# EAGLE design XE167FM (EAGLE 6.4)
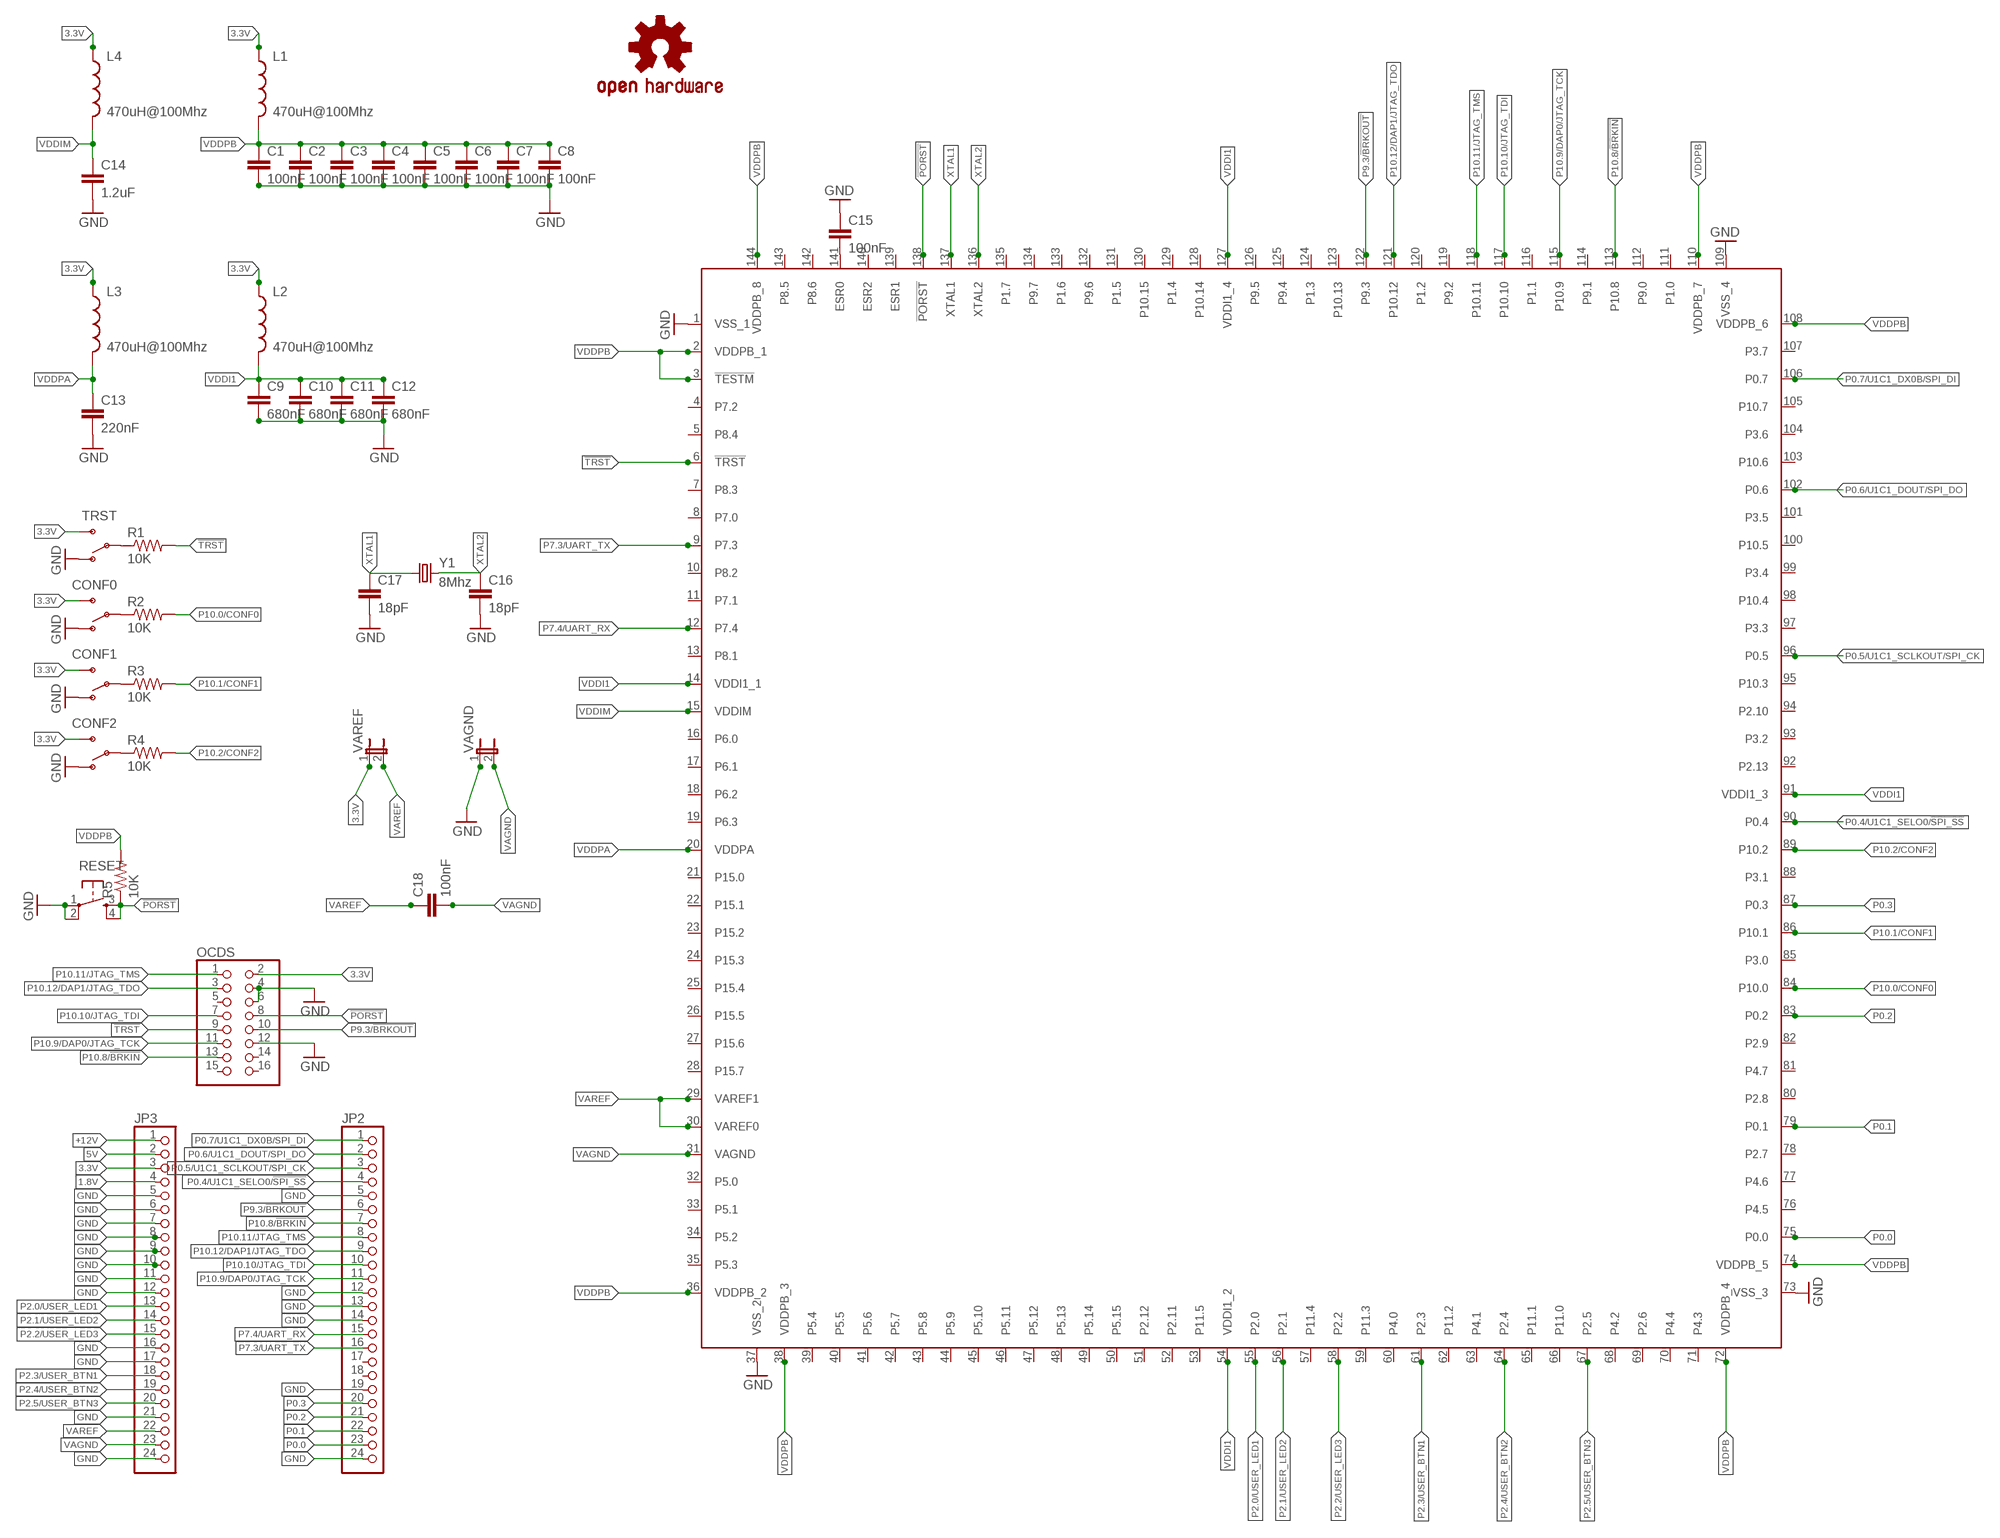
[diagram p0: schematic, sheet 1]

## Parts
C1  100nF  CAP0603-CAP  [0603-CAP]
C2  100nF  CAP0603-CAP  [0603-CAP]
C3  100nF  CAP0603-CAP  [0603-CAP]
C4  100nF  CAP0603-CAP  [0603-CAP]
C5  100nF  CAP0603-CAP  [0603-CAP]
C6  100nF  CAP0603-CAP  [0603-CAP]
C7  100nF  CAP0603-CAP  [0603-CAP]
C8  100nF  CAP0603-CAP  [0603-CAP]
C9  680nF  CAP0603-CAP  [0603-CAP]
C10  680nF  CAP0603-CAP  [0603-CAP]
C11  680nF  CAP0603-CAP  [0603-CAP]
C12  680nF  CAP0603-CAP  [0603-CAP]
C13  220nF  CAP0603-CAP  [0603-CAP]
C14  1.2uF  CAP0603-CAP  [0603-CAP]
C15  100nF  CAP0603-CAP  [0603-CAP]
C16  18pF  CAP0603-CAP  [0603-CAP]
C17  18pF  CAP0603-CAP  [0603-CAP]
C18  100nF  CAP0603-CAP  [0603-CAP]
CONF0  SWITCH-SPDTPTH  [SWITCH-SPDT]
CONF1  SWITCH-SPDTPTH  [SWITCH-SPDT]
CONF2  SWITCH-SPDTPTH  [SWITCH-SPDT]
IC1  XE167FM  [LQFP144]
JP2  PINHD-1X24  [1X24]
JP3  PINHD-1X24  [1X24]
L1  470uH@100Mhz  INDUCTOR0603  [0603]
L2  470uH@100Mhz  INDUCTOR0603  [0603]
L3  470uH@100Mhz  INDUCTOR0603  [0603]
L4  470uH@100Mhz  INDUCTOR0603  [0603]
LOGO1  OSHW-LOGOS  [OSHW-LOGO-S]
OCDS  PINHD-2X8_2.54  [2X08]
R1  10K  RESISTOR0603-RES  [0603-RES]
R2  10K  RESISTOR0603-RES  [0603-RES]
R3  10K  RESISTOR0603-RES  [0603-RES]
R4  10K  RESISTOR0603-RES  [0603-RES]
R5  10K  RESISTOR0603-RES  [0603-RES]
RESET  TAC_SWITCHPTH  [TACTILE-PTH]
TRST  SWITCH-SPDTPTH  [SWITCH-SPDT]
VAGND  JP1E  [JP1]
VAREF  JP1E  [JP1]
Y1  8Mhz  CRYSTALSMD  [HC49UP]

## Nets
1.8V: JP3.4
3.3V: CONF0.3(S) CONF1.3(S) CONF2.3(S) JP3.3 L1.1 L2.1 L3.1 L4.1 OCDS.2 TRST.3(S) VAREF.1
5V: JP3.2
!PORST: IC1.138(!PORST) OCDS.8 R5.1 RESET.3 RESET.4
!TRST: IC1.6(!TRST) OCDS.9 R1.2
+12V: JP3.1
GND: C1.2 C2.2 C3.2 C4.2 C5.2 C6.2 C7.2 C8.2 C9.2 C10.2 C11.2 C12.2 C13.2 C14.2 C15.1 C16.2 C17.2 CONF0.1(O) CONF1.1(O) CONF2.1(O) IC1.1(VSS_1) IC1.37(VSS_2) IC1.73(VSS_3) IC1.109(VSS_4) JP2.5 JP2.12 JP2.13 JP2.14 JP2.19 JP2.24 JP3.5 JP3.6 JP3.7 JP3.8 JP3.9 JP3.10 JP3.11 JP3.12 JP3.16 JP3.17 JP3.21 JP3.24 OCDS.4 OCDS.6 OCDS.12 RESET.1 RESET.2 TRST.1(O) VAGND.1
N$1: R1.1 TRST.2(P)
N$2: CONF0.2(P) R2.1
N$3: CONF1.2(P) R3.1
N$4: CONF2.2(P) R4.1
N$5: C15.2 IC1.141(ESR0)
P0.0: IC1.75(P0.0) JP2.23
P0.1: IC1.79(P0.1) JP2.22
P0.2: IC1.83(P0.2) JP2.21
P0.3: IC1.87(P0.3) JP2.20
P0.4/U1C1_SELO0/!SPI_SS: IC1.90(P0.4) JP2.4
P0.5/U1C1_SCLKOUT/SPI_CK: IC1.96(P0.5) JP2.3
P0.6/U1C1_DOUT/SPI_DO: IC1.102(P0.6) JP2.2
P0.7/U1C1_DX0B/SPI_DI: IC1.106(P0.7) JP2.1
P2.0/USER_LED1: IC1.55(P2.0) JP3.13
P2.1/USER_LED2: IC1.56(P2.1) JP3.14
P2.2/USER_LED3: IC1.58(P2.2) JP3.15
P2.3/USER_BTN1: IC1.61(P2.3) JP3.18
P2.4/USER_BTN2: IC1.64(P2.4) JP3.19
P2.5/USER_BTN3: IC1.67(P2.5) JP3.20
P7.3/UART_TX: IC1.9(P7.3) JP2.16
P7.4/UART_RX: IC1.12(P7.4) JP2.15
P9.3/!BRKOUT: IC1.122(P9.3) JP2.6 OCDS.10
P10.0/CONF0: IC1.84(P10.0) R2.2
P10.1/CONF1: IC1.86(P10.1) R3.2
P10.2/CONF2: IC1.89(P10.2) R4.2
P10.8/!BRKIN: IC1.113(P10.8) JP2.7 OCDS.13
P10.9/DAP0/JTAG_TCK: IC1.115(P10.9) JP2.11 OCDS.11
P10.10/JTAG_TDI: IC1.117(P10.10) JP2.10 OCDS.7
P10.11/JTAG_TMS: IC1.118(P10.11) JP2.8 OCDS.1
P10.12/DAP1/JTAG_TDO: IC1.121(P10.12) JP2.9 OCDS.3
VAGND: C18.2 IC1.31(VAGND) JP3.23 VAGND.2
VAREF: C18.1 IC1.29(VAREF1) IC1.30(VAREF0) JP3.22 VAREF.2
VDDI1: C9.1 C10.1 C11.1 C12.1 IC1.14(VDDI1_1) IC1.54(VDDI1_2) IC1.91(VDDI1_3) IC1.127(VDDI1_4) L2.2
VDDIM: C14.1 IC1.15(VDDIM) L4.2
VDDPA: C13.1 IC1.20(VDDPA) L3.2
VDDPB: C1.1 C2.1 C3.1 C4.1 C5.1 C6.1 C7.1 C8.1 IC1.2(VDDPB_1) IC1.3(!TESTM) IC1.36(VDDPB_2) IC1.38(VDDPB_3) IC1.72(VDDPB_4) IC1.74(VDDPB_5) IC1.108(VDDPB_6) IC1.110(VDDPB_7) IC1.144(VDDPB_8) L1.2 R5.2
XTAL1: C17.1 IC1.137(XTAL1) Y1.1
XTAL2: C16.1 IC1.136(XTAL2) Y1.2
Unconnected: IC1.4(P7.2) IC1.5(P8.4) IC1.7(P8.3) IC1.8(P7.0) IC1.10(P8.2) IC1.11(P7.1) IC1.13(P8.1) IC1.16(P6.0) IC1.17(P6.1) IC1.18(P6.2) IC1.19(P6.3) IC1.21(P15.0) IC1.22(P15.1) IC1.23(P15.2) IC1.24(P15.3) IC1.25(P15.4) IC1.26(P15.5) IC1.27(P15.6) IC1.28(P15.7) IC1.32(P5.0) IC1.33(P5.1) IC1.34(P5.2) IC1.35(P5.3) IC1.39(P5.4) IC1.40(P5.5) IC1.41(P5.6) IC1.42(P5.7) IC1.43(P5.8) IC1.44(P5.9) IC1.45(P5.10) IC1.46(P5.11) IC1.47(P5.12) IC1.48(P5.13) IC1.49(P5.14) IC1.50(P5.15) IC1.51(P2.12) IC1.52(P2.11) IC1.53(P11.5) IC1.57(P11.4) IC1.59(P11.3) IC1.60(P4.0) IC1.62(P11.2) IC1.63(P4.1) IC1.65(P11.1) IC1.66(P11.0) IC1.68(P4.2) IC1.69(P2.6) IC1.70(P4.4) IC1.71(P4.3) IC1.76(P4.5) IC1.77(P4.6) IC1.78(P2.7) IC1.80(P2.8) IC1.81(P4.7) IC1.82(P2.9) IC1.85(P3.0) IC1.88(P3.1) IC1.92(P2.13) IC1.93(P3.2) IC1.94(P2.10) IC1.95(P10.3) IC1.97(P3.3) IC1.98(P10.4) IC1.99(P3.4) IC1.100(P10.5) IC1.101(P3.5) IC1.103(P10.6) IC1.104(P3.6) IC1.105(P10.7) IC1.107(P3.7) IC1.111(P1.0) IC1.112(P9.0) IC1.114(P9.1) IC1.116(P1.1) IC1.119(P9.2) IC1.120(P1.2) IC1.123(P10.13) IC1.124(P1.3) IC1.125(P9.4) IC1.126(P9.5) IC1.128(P10.14) IC1.129(P1.4) IC1.130(P10.15) IC1.131(P1.5) IC1.132(P9.6) IC1.133(P1.6) IC1.134(P9.7) IC1.135(P1.7) IC1.139(ESR1) IC1.140(ESR2) IC1.142(P8.6) IC1.143(P8.5) JP2.17 JP2.18 OCDS.5 OCDS.14 OCDS.15 OCDS.16

## Library data of the parts
C1-C18 = SparkFun-Capacitors:CAP: Capacitor Standard 0603 ceramic capacitor, and 0.1" leaded capacitor.
CONF0 CONF1 CONF2 TRST = SparkFun-Electromechanical:SWITCH-SPDT: SPDT Switch Simple slide switch, Spark Fun Electronics SKU : COM-00102 DPDT SMT slide switch, AYZ0202, SWCH-08179
IC1 = xe167_lqfp144:XE167FM: Infineon XE167FM
JP2 JP3 = pinhead:PINHD-1X24: PIN HEADER
L1-L4 = SparkFun-Passives:INDUCTOR: Inductors Basic Inductor/Choke - 0603 and 1206. Footprints are not proven and vary greatly between part numbers.
LOGO1 = SparkFun-Aesthetics:OSHW-LOGO: Open Source Hardware Logo This logo indicates the piece of hardware it is found on incorporates a OSHW license and/or adheres to the definition of open source hardware found here: http://freedomdefined.org/OSHW
OCDS = pinhead:PINHD-2X8: PIN HEADER
R1-R5 = SparkFun-Resistors:RESISTOR: Resistor Basic schematic elements and footprints for 0603, 1206, and PTH resistors.
RESET = SparkFun-Electromechanical:TAC_SWITCH: Momentary Switch Button commonly used for reset or general input. Spark Fun Electronics SKU : COM-00097 SMT- SWCH-08247
VAGND VAREF = jumper:JP1E: JUMPER
Y1 = SparkFun-FreqCtrl:CRYSTAL: Various standard crystals. Proven footprints. Spark Fun Electronics SKU : COM-00534

## Net classes
0 default: clearance 0.355 mm

## Board
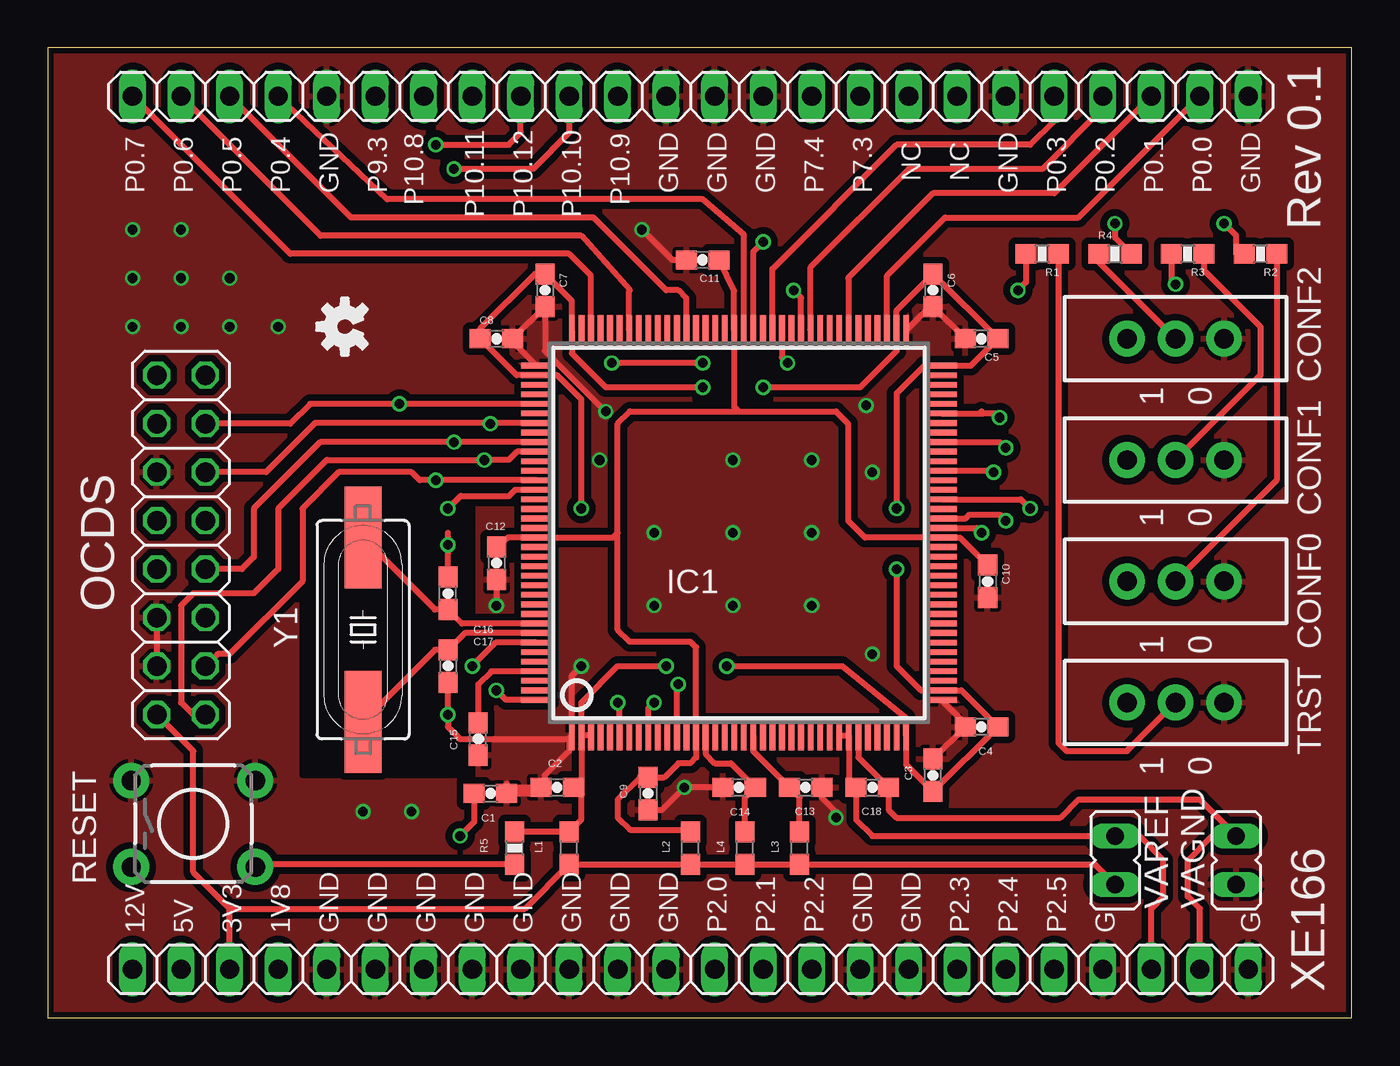
[diagram p1: board, top side]
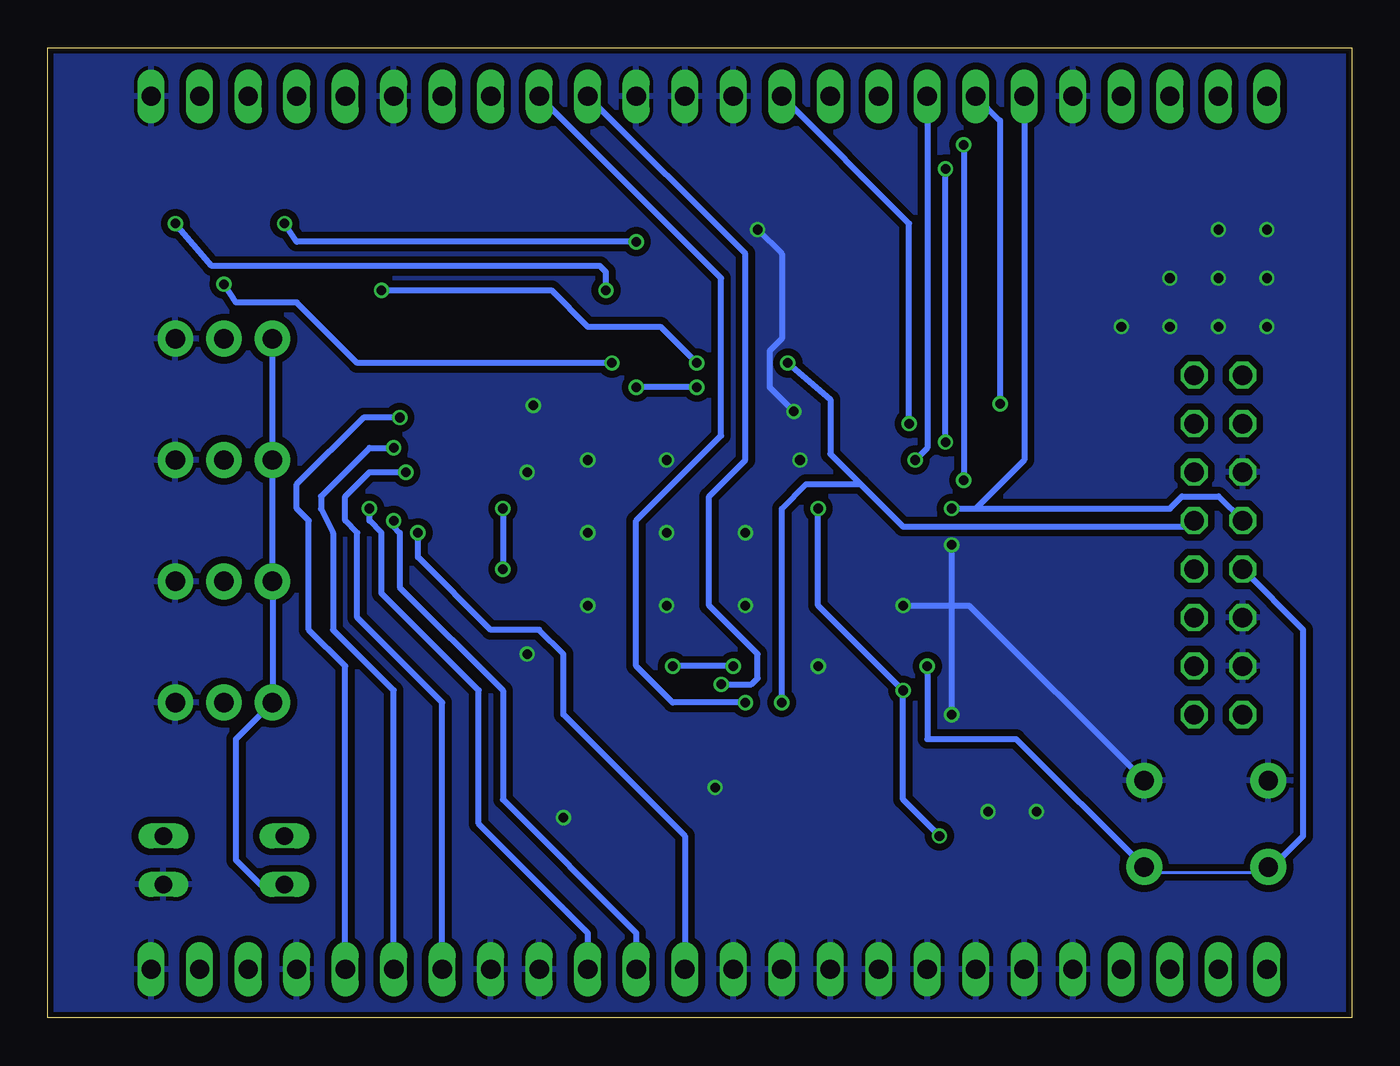
[diagram p2: board, bottom side, seen from below]

Size 68.28 x 50.8 mm. Coordinates in mm from the lower left corner, seen from the top.
Outline: 0,0 68.28,0 68.28,50.8 0,50.8 0,0
Copper layers (1*16): Top 0.035mm / dielectric 1.5mm / Bottom 0.035mm
Design rules "PCB-POOL Standard": minimum track width 0.15mm, minimum drill 0.3mm, track to track 0.15mm, track to pad 0.15mm, pad to pad 0.15mm, via to via 0.15mm, smd to smd 0.15mm, copper to edge 0.3mm, drill to drill 0.2mm, minimum pad ring 0.2mm, minimum via ring 0.15mm, stop-mask expansion 0.075mm, vias tented up to drill 0mil, thermal gap 0.2mm

### Footprints (pad centres in the part's own frame; a part is rotated, then mirrored left to right if it is on the bottom)
0603-CAP = smd 1.1 x 1: 1 -0.85,0; 2 0.85,0
SWITCH-SPDT = drill 1.016 pad 1.88: 1 0,2.54; 2 0,0; 3 0,-2.54
LQFP144 = smd 0.3 x 1.6: 1 -17.64,-13.14; 2 -17.14,-13.14; 3 -16.64,-13.14; 4 -16.14,-13.14; 5 -15.64,-13.14; 6 -15.14,-13.14; 7 -14.64,-13.14; 8 -14.14,-13.14; 9 -13.64,-13.14; 10 -13.14,-13.14; 11 -12.64,-13.14; 12 -12.14,-13.14; 13 -11.64,-13.14; 14 -11.14,-13.14; 15 -10.64,-13.14; 16 -10.14,-13.14; 17 -9.64,-13.14; 18 -9.14,-13.14; 19 -8.64,-13.14; 20 -8.14,-13.14; 21 -7.64,-13.14; 22 -7.14,-13.14; 23 -6.64,-13.14; 24 -6.14,-13.14; 25 -5.64,-13.14; 26 -5.14,-13.14; 27 -4.64,-13.14; 28 -4.14,-13.14; 29 -3.64,-13.14; 30 -3.14,-13.14; 31 -2.64,-13.14; 32 -2.14,-13.14; 33 -1.64,-13.14; 34 -1.14,-13.14; 35 -0.64,-13.14; 36 -0.14,-13.14; 73 -0.14,8.06; 74 -0.64,8.06; 75 -1.14,8.06; 76 -1.64,8.06; 77 -2.14,8.06; 78 -2.64,8.06; 79 -3.14,8.06; 80 -3.64,8.06; 81 -4.14,8.06; 82 -4.64,8.06; 83 -5.14,8.06; 84 -5.64,8.06; 85 -6.14,8.06; 86 -6.64,8.06; 87 -7.14,8.06; 88 -7.64,8.06; 89 -8.14,8.06; 90 -8.64,8.06; 91 -9.14,8.06; 92 -9.64,8.06; 93 -10.14,8.06; 94 -10.64,8.06; 95 -11.14,8.06; 96 -11.64,8.06; 97 -12.14,8.06; 98 -12.64,8.06; 99 -13.14,8.06; 100 -13.64,8.06; 101 -14.14,8.06; 102 -14.64,8.06; 103 -15.14,8.06; 104 -15.64,8.06; 105 -16.14,8.06; 106 -16.64,8.06; 107 -17.14,8.06; 108 -17.64,8.06 | smd 1.6 x 0.3: 37 1.71,-11.29; 38 1.71,-10.79; 39 1.71,-10.29; 40 1.71,-9.79; 41 1.71,-9.29; 42 1.71,-8.79; 43 1.71,-8.29; 44 1.71,-7.79; 45 1.71,-7.29; 46 1.71,-6.79; 47 1.71,-6.29; 48 1.71,-5.79; 49 1.71,-5.29; 50 1.71,-4.79; 51 1.71,-4.29; 52 1.71,-3.79; 53 1.71,-3.29; 54 1.71,-2.79; 55 1.71,-2.29; 56 1.71,-1.79; 57 1.71,-1.29; 58 1.71,-0.79; 59 1.71,-0.29; 60 1.71,0.21; 61 1.71,0.71; 62 1.71,1.21; 63 1.71,1.71; 64 1.71,2.21; 65 1.71,2.71; 66 1.71,3.21; 67 1.71,3.71; 68 1.71,4.21; 69 1.71,4.71; 70 1.71,5.21; 71 1.71,5.71; 72 1.71,6.21; 109 -19.49,6.21; 110 -19.49,5.71; 111 -19.49,5.21; 112 -19.49,4.71; 113 -19.49,4.21; 114 -19.49,3.71; 115 -19.49,3.21; 116 -19.49,2.71; 117 -19.49,2.21; 118 -19.49,1.71; 119 -19.49,1.21; 120 -19.49,0.71; 121 -19.49,0.21; 122 -19.49,-0.29; 123 -19.49,-0.79; 124 -19.49,-1.29; 125 -19.49,-1.79; 126 -19.49,-2.29; 127 -19.49,-2.79; 128 -19.49,-3.29; 129 -19.49,-3.79; 130 -19.49,-4.29; 131 -19.49,-4.79; 132 -19.49,-5.29; 133 -19.49,-5.79; 134 -19.49,-6.29; 135 -19.49,-6.79; 136 -19.49,-7.29; 137 -19.49,-7.79; 138 -19.49,-8.29; 139 -19.49,-8.79; 140 -19.49,-9.29; 141 -19.49,-9.79; 142 -19.49,-10.29; 143 -19.49,-10.79; 144 -19.49,-11.29
1X24 = drill 1.016 long: 1 -29.21,0; 2 -26.67,0; 3 -24.13,0; 4 -21.59,0; 5 -19.05,0; 6 -16.51,0; 7 -13.97,0; 8 -11.43,0; 9 -8.89,0; 10 -6.35,0; 11 -3.81,0; 12 -1.27,0; 13 1.27,0; 14 3.81,0; 15 6.35,0; 16 8.89,0; 17 11.43,0; 18 13.97,0; 19 16.51,0; 20 19.05,0; 21 21.59,0; 22 24.13,0; 23 26.67,0; 24 29.21,0
0603 = smd 1.1 x 1: 1 -0.85,0; 2 0.85,0
2X08 = drill 1.016 octagon: 1 -8.89,-1.27; 2 -8.89,1.27; 3 -6.35,-1.27; 4 -6.35,1.27; 5 -3.81,-1.27; 6 -3.81,1.27; 7 -1.27,-1.27; 8 -1.27,1.27; 9 1.27,-1.27; 10 1.27,1.27; 11 3.81,-1.27; 12 3.81,1.27; 13 6.35,-1.27; 14 6.35,1.27; 15 8.89,-1.27; 16 8.89,1.27
0603-RES = smd 1.1 x 1: 1 -0.85,0; 2 0.85,0
TACTILE-PTH = drill 1.016 pad 1.88: 1 -3.251,2.261; 2 3.251,2.261; 3 -3.251,-2.261; 4 3.251,-2.261
JP1 = drill 0.914 long: 1 0,-1.27; 2 0,1.27
HC49UP = smd 5.334 x 1.93: 1 -4.826,0; 2 4.826,0

### Placement (x,y rotation side)
C1  23.18,11.75 0 top
C2  26.67,12.06 180 top
C3  46.36,12.7 90 top
C4  48.9,15.24 180 top
C5  48.9,35.56 180 top
C6  46.36,38.1 270 top
C7  26.04,38.1 270 top
C8  23.5,35.56 0 top
C9  31.43,11.75 270 top
C10  49.21,22.86 270 top
C11  34.29,39.69 180 top
C12  23.5,23.81 270 top
C13  39.69,12.06 0 top
C14  36.2,12.06 180 top
C15  22.54,14.61 90 top
C16  20.96,22.23 90 top
C17  20.96,18.41 270 top
C18  43.18,12.06 0 top
CONF0  59.05,22.86 270 top
CONF1  59.05,29.21 270 top
CONF2  59.05,35.56 270 top
IC1  45.09,27.94 0 top
JP2  33.66,48.26 0 top
JP3  33.66,2.54 0 top
L1  27.3,8.89 90 top
L2  33.66,8.89 90 top
L3  39.37,8.89 90 top
L4  36.51,8.89 90 top
LOGO1  15.56,36.2 90 top
OCDS  6.99,24.77 90 top
R1  52.07,40.01 180 top
R2  63.5,40.01 180 top
R3  59.69,40.01 180 top
R4  55.88,40.01 0 top
R5  24.45,8.89 90 top
RESET  7.62,10.16 0 top
TRST  59.05,16.51 270 top
VAGND  62.23,8.26 0 top
VAREF  55.88,8.26 0 top
Y1  16.51,20.32 90 top

### Tracks (layer width: path | path; a pad name or v marks a point on that pad's centre or on a via)
3.3V
  Top 0.305: JP3.3 9.53,5.71 | 9.53,5.71 7.62,7.62 7.62,13.97 OCDS.2 | 9.53,5.71 24.98,5.71 L1.1 L2.1 L4.1 L3.1 54.83,8.04 VAREF.1
  Bottom 0.305: VAREF.1 57.15,6.99 58.42,8.26 58.42,14.61 TRST.3 CONF0.3 CONF1.3 CONF2.3
!PORST  (via drill 0.5)
  Top 0.305: IC1.138 23.46,19.65 v22.23,18.41 | R5.1 11.01,8.04 RESET.4
  Bottom 0.15: RESET.3 4.45,7.62 10.79,7.62 RESET.4
  Bottom 0.305: v22.23,18.41 22.23,14.61 17.58,14.61 RESET.4 | RESET.3 4.17,7.9 2.54,9.53 2.54,20.32 OCDS.8
!TRST  (via drill 0.5)
  Top 0.305: IC1.6 29.95,16.41 v29.85,16.51 | v34.29,34.29 v29.53,34.29 | R1.2 51.22,38.52 v50.8,38.1
  Bottom 0.305: v29.85,16.51 29.85,26.67 28.58,27.94 25.72,27.94 | 25.72,27.94 23.5,25.72 8.57,25.72 OCDS.9 | v50.8,38.1 41.91,38.1 40.01,36.2 36.2,36.2 v34.29,34.29 | v29.53,34.29 27.3,32.38 27.3,29.53 25.72,27.94
GND  (via drill 0.5)
  Top 0.305: OCDS.6 OCDS.4 | 27.25,14.61 21.59,14.61 20.96,15.24 v20.96,15.88 C17.2 | 27.25,14.61 IC1.1 27.45,17.92 v27.94,18.41 | C16.2 v20.96,24.77 20.96,25.4 | C5.2 C6.2 46.2,37.25 IC1.73 | IC1.109 24.35,35.4 C8.2 C7.2 26.04,34.92 v29.21,31.75 | C3.2 C4.2 48.05,15.4 IC1.37 | C9.2 32.17,10.9 v33.34,12.06 C14.2 | C13.2 40.54,11.53 41.27,10.79 v41.27,10.48 | C11.2 32.7,39.69 v31.12,41.27 | C12.2 v23.5,21.59 | 24.03,12.27 C1.2 25.5,11.75 C2.2 | C15.1 22.54,13.65 | 24.13,12.06 26.04,12.06 26.04,12.7 27.3,13.97 27.3,14.61 27.25,14.61
  Bottom 0.305: v20.96,24.77 v20.96,15.88 | v23.5,21.59 20.04,21.59 RESET.2 | v31.12,41.27 29.85,40.01 29.85,35.56 30.48,34.92 30.48,33.02 v29.21,31.75
  other vias: 42.86,32.07 43.18,28.57 35.88,25.4 40.01,25.4 31.75,25.4 31.75,21.59 35.88,29.21 40.01,29.21 40.01,21.59 35.88,21.59 43.18,19.05 28.89,29.21 4.45,41.27 4.45,38.73 4.45,36.2 6.99,38.73 9.53,38.73 6.99,36.2 9.53,36.2 6.99,41.27 12.06,36.2 16.51,10.79 19.05,10.79
  pour Top: 23.5,38.1 48.9,38.1 48.9,12.7 23.5,12.7
  pour Bottom (isolate 0.305): 0,50.8 67.95,50.8 67.95,0 0,0
  pour Top (isolate 0.305): 0,50.8 67.95,50.8 67.95,0 0,0
N$1
  Top 0.305: R1.1 52.92,14.39 53.34,13.97 56.52,13.97 TRST.2
N$2
  Top 0.305: R2.1 64.35,28.16 CONF0.2
N$3
  Top 0.305: R3.1 60.54,39.16 63.5,36.2 63.5,33.66 CONF1.2
N$4
  Top 0.305: R4.1 55.03,39.59 CONF2.2
N$5
  Top 0.305: IC1.141 23.23,18.15 22.54,17.46 C15.2
OSC
  cutout Top: 13.33,27.94 22.23,27.94 22.23,12.7 13.33,12.7
P0.0
  Top 0.305: IC1.75 43.95,38.87 46.99,41.91 53.98,41.91 JP2.23
P0.1
  Top 0.305: JP2.22 52.7,43.18 46.36,43.18 41.91,38.73 41.95,38.7 IC1.79
P0.2
  Top 0.305: JP2.21 55.25,47.62 52.07,44.45 45.09,44.45 39.95,39.31 IC1.83
P0.3
  Top 0.305: JP2.20 52.7,46.99 51.44,45.72 44.45,45.72 37.95,39.22 IC1.87
P0.4/U1C1_SELO0/!SPI_SS
  Top 0.305: IC1.90 36.45,41.02 34.29,42.86 17.78,42.86 JP2.4
P0.5/U1C1_SCLKOUT/SPI_CK
  Top 0.305: IC1.96 33.45,37.67 33.02,38.1 32.38,38.1 28.58,41.91 15.88,41.91 JP2.3
P0.6/U1C1_DOUT/SPI_DO
  Top 0.305: IC1.102 30.45,38.06 30.48,38.1 27.94,40.96 14.29,40.96 JP2.2
P0.7/U1C1_DX0B/SPI_DI
  Top 0.305: IC1.106 28.45,38.87 27.3,40.01 12.7,40.01 JP2.1
P2.0/USER_LED1  (via drill 0.5)
  Top 0.305: IC1.55 48.65,25.65 v48.9,25.4
  Bottom 0.305: JP3.13 34.93,9.53 41.27,15.88 41.27,19.05 42.55,20.32 45.09,20.32 48.9,24.13 v48.9,25.4
P2.1/USER_LED2  (via drill 0.5)
  Top 0.305: 50.05,26.15 v50.16,26.04 49.85,26.35 48.26,26.35 48.06,26.15 IC1.56
  Bottom 0.305: JP3.14 37.47,4.45 44.45,11.43 44.45,17.14 49.85,22.54 49.85,25.4 50.16,25.72 v50.16,26.04
P2.2/USER_LED3  (via drill 0.5)
  Top 0.305: IC1.58 50.95,27.15 v51.44,26.67
  Bottom 0.305: JP3.15 40.01,4.45 45.72,10.16 45.72,17.14 50.8,22.23 50.8,25.4 51.44,26.04 v51.44,26.67
P2.3/USER_BTN1  (via drill 0.5)
  Top 0.305: IC1.61 49.45,28.65 v49.53,28.57
  Bottom 0.305: JP3.18 47.62,16.51 52.07,20.95 52.07,25.4 52.7,26.04 52.7,27.3 51.44,28.57 v49.53,28.57
P2.4/USER_BTN2  (via drill 0.5)
  Top 0.305: IC1.64 49.86,30.15 v50.16,29.84
  Bottom 0.305: JP3.19 50.16,17.14 53.34,20.32 53.34,25.4 53.98,26.67 53.98,27.3 51.44,29.84 v50.16,29.84
P2.5/USER_BTN3  (via drill 0.5)
  Top 0.305: 48.8,31.65 48.9,31.75 49,31.65 | IC1.67 49,31.65 | v49.85,31.43 49.63,31.65 49,31.65
  Bottom 0.305: JP3.20 52.7,18.41 54.61,20.32 54.61,26.04 55.25,26.67 55.25,27.94 51.75,31.43 v49.85,31.43
P7.3/UART_TX  (via drill 0.5)
  Top 0.305: IC1.9 31.45,16.2 v31.75,16.51
  Bottom 0.305: v31.75,16.51 35.56,16.51 37.47,18.41 37.47,26.04 33.02,30.48 33.02,38.73 JP2.16
P7.4/UART_RX  (via drill 0.5)
  Top 0.305: IC1.12 32.95,17.39 v33.02,17.46
  Bottom 0.305: v33.02,17.46 31.43,17.46 31.12,17.78 31.12,19.05 33.66,21.59 33.66,27.3 31.75,29.21 31.75,40.01 JP2.15
P9.3/!BRKOUT  (via drill 0.5)
  Top 0.305: v20.96,26.67 21.62,27.33 21.64,27.3 24.13,27.3 24.48,27.65 IC1.122
  Bottom 0.305: v20.96,26.67 19.69,26.67 | 19.69,26.67 9.53,26.67 8.89,27.3 6.99,27.3 OCDS.10 | JP2.6 17.14,29.21 19.69,26.67
P10.0/CONF0  (via drill 0.5)
  Top 0.305: IC1.84 39.45,37.71 v39.05,38.1 | v61.59,41.59 62.23,40.96 62.23,40.01 R2.2
  Bottom 0.305: v39.05,38.1 39.05,39.05 39.37,39.37 59.69,39.37 v61.59,41.59
P10.1/CONF1  (via drill 0.5)
  Top 0.305: IC1.86 38.45,34.58 v38.73,34.29 | R3.2 58.84,38.63 v59.05,38.42
  Bottom 0.305: v38.73,34.29 52.07,34.29 55.25,37.47 58.42,37.47 v59.05,38.42
P10.2/CONF2  (via drill 0.5)
  Top 0.305: IC1.89 36.95,40.12 v37.47,40.64 | v55.88,41.59 55.88,40.85 R4.2
  Bottom 0.305: v37.47,40.64 55.25,40.64 v55.88,41.59
P10.8/!BRKIN  (via drill 0.5)
  Top 0.305: IC1.113 v18.42,32.15 13.73,32.15 12.7,31.11 OCDS.13
  Bottom 0.305: JP2.7 18.42,46.99 v18.42,32.15
P10.9/DAP0/JTAG_TCK  (via drill 0.5)
  Top 0.305: IC1.115 23.46,31.15 | 23.46,31.15 14,31.15 11.43,28.57 OCDS.11 | 23.46,31.15 v23.18,31.11
  Bottom 0.305: JP2.11 23.18,41.59 v23.18,31.11
P10.10/JTAG_TDI  (via drill 0.5)
  Top 0.305: IC1.117 v21.27,30.15 14.27,30.15 10.79,26.67 10.79,24.13 10.16,23.5 OCDS.7 | JP2.10 27.3,46.35 25.4,44.45 v21.27,44.45
  Bottom 0.305: v21.27,30.15 v21.27,44.45
P10.11/JTAG_TMS  (via drill 0.5)
  Top 0.305: OCDS.1 7.62,15.88 6.99,16.51 6.99,21.59 7.62,22.23 10.79,22.23 12.06,23.5 12.06,26.67 14.6,29.21 v22.86,29.21 24.13,29.21 24.57,29.65 IC1.118
  Bottom 0.305: JP2.8 22.23,29.84 v22.86,29.21
P10.12/DAP1/JTAG_TDO  (via drill 0.5)
  Top 0.305: IC1.121 v20.32,28.15 19.48,28.15 19.05,28.57 15.24,28.57 13.33,26.67 13.33,22.86 9.53,19.05 8.89,19.05 OCDS.3 | v20.32,45.72 24.13,45.72 24.77,46.35 JP2.9
  Bottom 0.305: v20.32,45.72 v20.32,28.15
VAGND
  Top 0.305: IC1.31 42.45,13.65 C18.2 44.03,10.9 44.45,10.48 53.02,10.48 53.98,11.43 60.33,11.43 VAGND.2 60.96,9.53 59.69,8.26 59.69,6.35 60.33,5.71 JP3.23
VAREF
  Top 0.305: IC1.29 IC1.30 41.95,12.45 C18.1 42.33,10.38 43.18,9.53 VAREF.2 57.15,9.53 58.42,8.26 58.42,6.35 57.79,5.71 JP3.22
VDDI1
  Top 0.305: C11.1 35.95,38.06 IC1.91 35.95,32 36.2,31.75 | 29.85,25.4 29.85,20.32 30.48,19.68 33.66,19.68 33.95,19.39 IC1.14 33.95,13.62 33.66,13.34 33.02,13.34 32.28,12.6 C9.1 31.01,12.6 29.85,11.43 29.85,10.48 30.48,9.84 33.55,9.84 L2.2 | 29.85,25.4 29.85,31.11 30.48,31.75 36.2,31.75 | 36.2,31.75 41.27,31.75 41.91,31.11 41.91,26.04 42.8,25.15 IC1.54 47.77,25.15 C10.1 | 29.85,25.4 29.6,25.15 IC1.127 24.1,25.15 C12.1
VDDIM
  Top 0.305: IC1.15 34.45,13.81 34.93,13.34 35.77,13.34 C14.1 36.51,11.53 L4.2
VDDPA
  Top 0.305: IC1.20 36.95,13.96 C13.1 39.37,11.53 L3.2
VDDPB  (via drill 0.5)
  Top 0.305: IC1.3 IC1.2 | IC1.2 27.95,11.64 | IC1.2 27.95,16.5 27.94,16.51 29.85,18.41 v32.38,18.41 | v35.56,18.41 41.59,18.41 44.95,15.7 IC1.36 44.95,13.26 C3.1 C4.1 47.84,17.15 IC1.38 45.72,17.14 44.45,18.41 v44.45,23.5 | v44.45,26.67 44.45,32.7 45.9,34.15 IC1.72 48.34,34.15 C5.1 C6.1 44.45,37.04 IC1.74 44.45,34.92 42.55,33.02 v37.47,33.02 | v34.29,33.02 29.21,33.02 27.45,34.78 IC1.108 27.45,37.54 C7.1 25.51,38.95 22.64,36.08 C8.1 24.55,33.65 IC1.110 26.67,33.66 27.94,32.38 v27.94,26.67 | IC1.144 23.99,16.65 v23.5,17.14 | R5.2 L1.2 27.95,10.38 27.95,11.64 | 27.95,11.64 C2.1 | C1.1 22.33,10.26 v21.59,9.53
  Bottom 0.305: v32.38,18.41 v35.56,18.41 | v44.45,26.67 v44.45,23.5 | v34.29,33.02 v37.47,33.02 | v27.94,26.67 27.94,21.59 v23.5,17.14 23.5,11.43 v21.59,9.53
XTAL1
  Top 0.305: IC1.137 21.84,20.15 C17.1 | C17.1 20.96,19.05 | 16.51,14.61 Y1.1 20.28,19.27 C17.1
XTAL2
  Top 0.305: IC1.136 21.68,20.65 C16.1 20.28,21.38 Y1.2

### Text on the board
tNames: NC | NC | P0.7 | P0.6 | P0.5 | P0.4 | GND | P9.3 | P10.8 | P10.9 | GND | GND | GND | P7.4 | P7.3 | GND | P0.3 | P0.2 | P0.1 | P0.0 | P0.0 | GND | P10.11 | P10.12 | P10.10 | Rev 0.1 | 1 | 0 | 1 | 0 | 1 | 0 | 1 | 0 | XE166 | 12V | 5V | 3V3 | 1V8 | GND | GND | GND | GND | GND | GND | GND | GND | P2.0 | P2.1 | P2.2 | GND | GND | P2.3 | P2.4 | P2.5 | G | G